# EAGLE design EgyptATTINY44 (EAGLE 9.5.2)
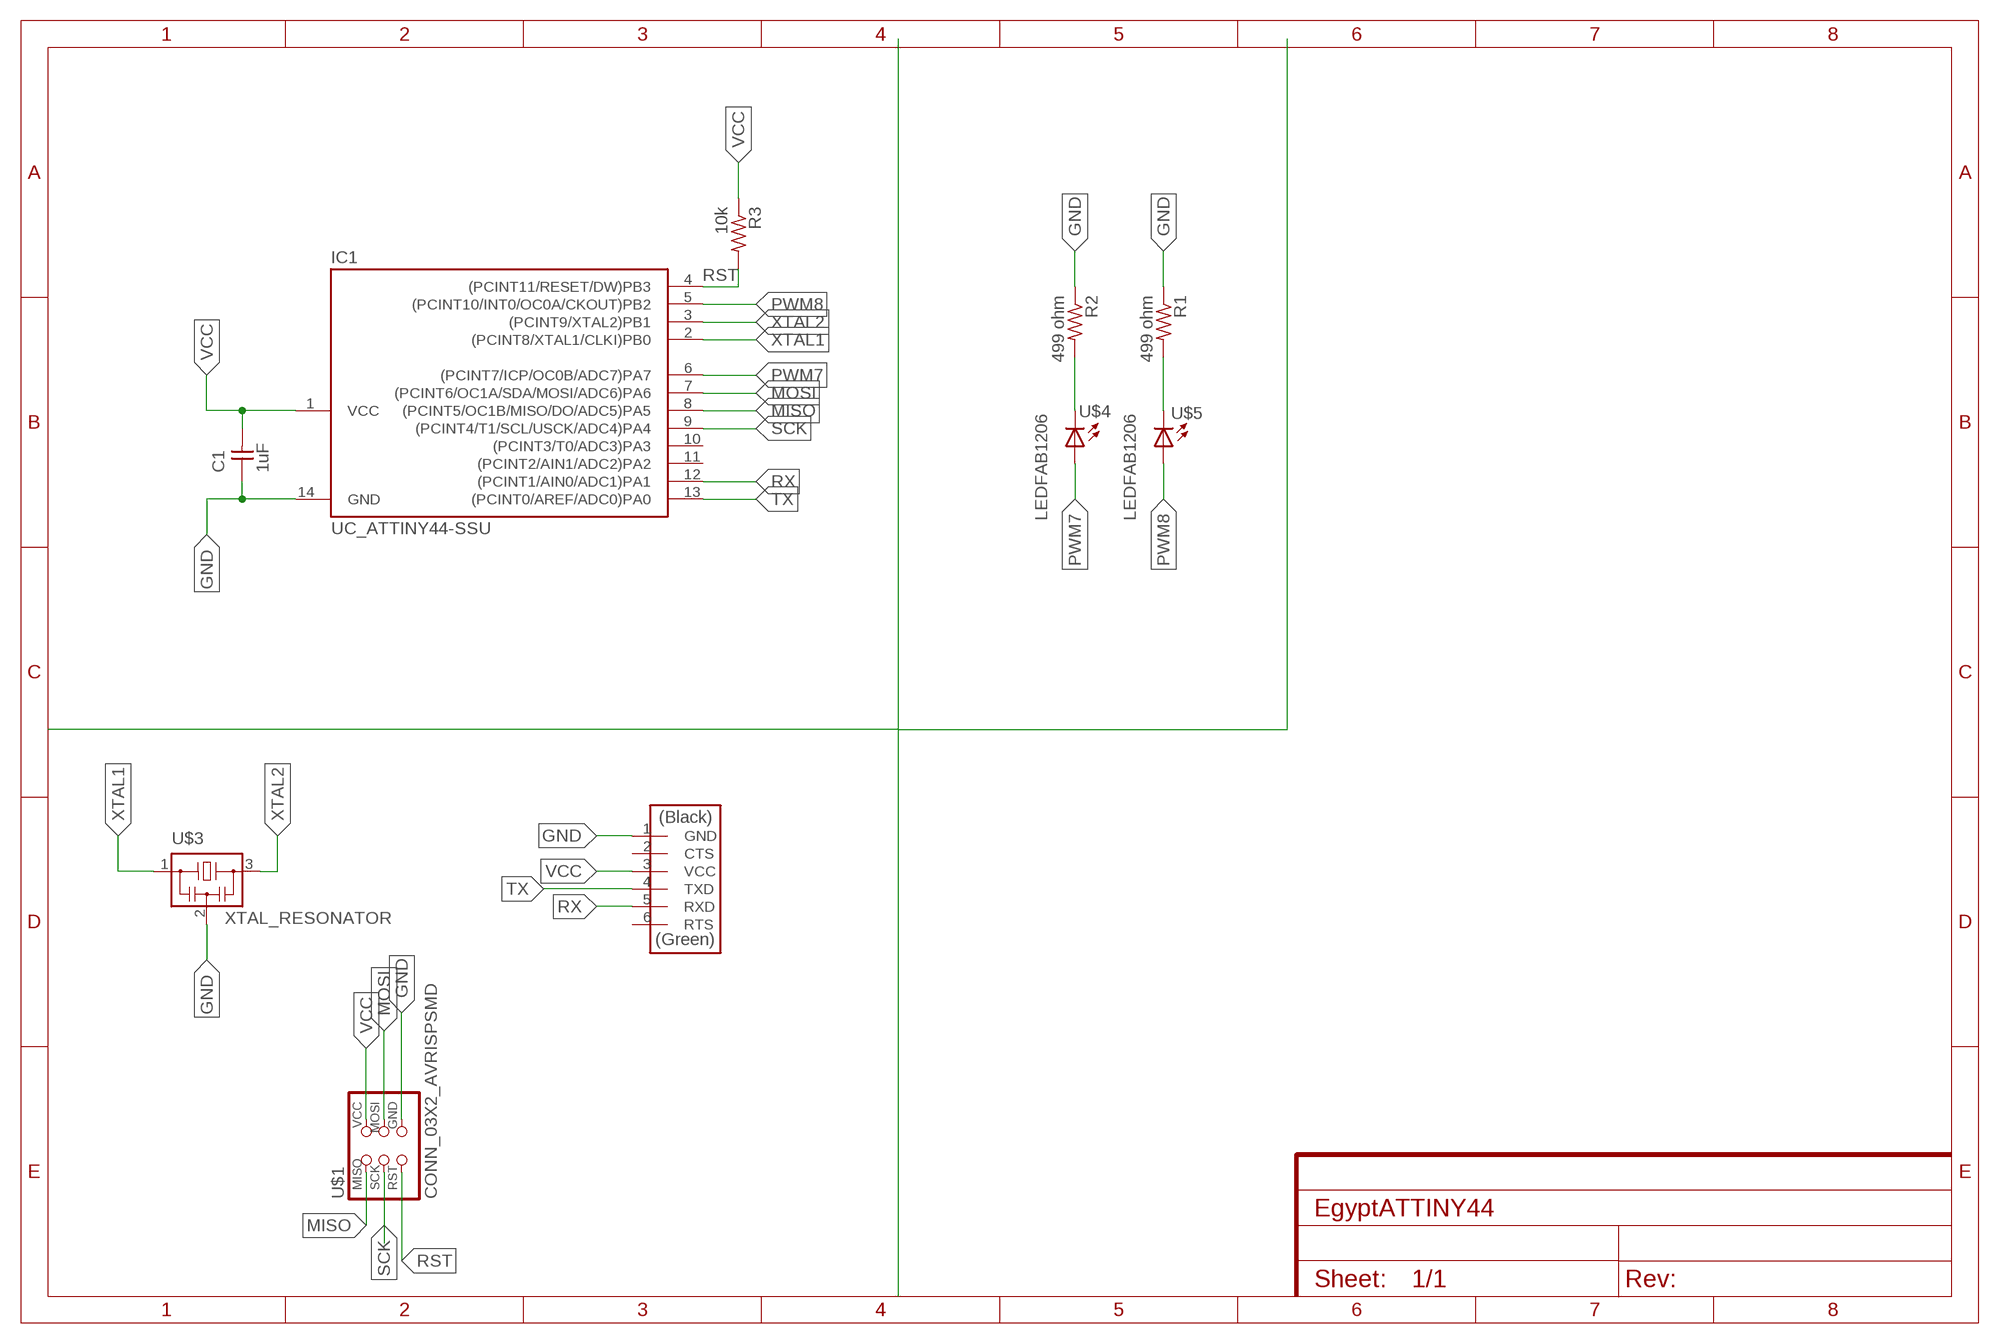
[diagram p0: schematic, sheet 1]

## Parts
C1  1uF  CAP_UNPOLARIZEDFAB  [C1206FAB]
IC1  UC_ATTINY44-SSU  [SOIC14]
R1  499 ohm  R1206FAB  [R1206FAB]
R2  499 ohm  R1206FAB  [R1206FAB]
R3  10k  R1206FAB  [R1206FAB]
U$1  CONN_03X2_AVRISPSMD  [2X03SMD]
U$2  CONN_06_FTDI-SMD-HEADER  [1X06SMD]
U$3  XTAL_RESONATOR  [EFOBM]
U$4  LEDFAB1206  [LED1206FAB]
U$5  LEDFAB1206  [LED1206FAB]

## Nets
GND: C1.1 IC1.14(GND) R1.1 R2.1 U$1.6(GND) U$2.1(GND) U$3.2
MISO: IC1.8((PCINT5/OC1B/MISO/DO/ADC5)PA5) U$1.1(MISO)
MOSI: IC1.7((PCINT6/OC1A/SDA/MOSI/ADC6)PA6) U$1.4(MOSI)
N$3: R2.2 U$4.2(C)
N$4: R1.2 U$5.2(C)
PWM7: IC1.6((PCINT7/ICP/OC0B/ADC7)PA7) U$4.1(A)
PWM8: IC1.5((PCINT10/INT0/OC0A/CKOUT)PB2) U$5.1(A)
RST: IC1.4((PCINT11/RESET/DW)PB3) R3.2 U$1.5(RST)
RX: IC1.12((PCINT1/AIN0/ADC1)PA1) U$2.5(RXD)
SCK: IC1.9((PCINT4/T1/SCL/USCK/ADC4)PA4) U$1.3(SCK)
TX: IC1.13((PCINT0/AREF/ADC0)PA0) U$2.4(TXD)
VCC: C1.2 IC1.1(VCC) R3.1 U$1.2(VCC) U$2.3(VCC)
XTAL1: IC1.2((PCINT8/XTAL1/CLKI)PB0) U$3.1
XTAL2: IC1.3((PCINT9/XTAL2)PB1) U$3.3
Unconnected: IC1.10((PCINT3/T0/ADC3)PA3) IC1.11((PCINT2/AIN1/ADC2)PA2) U$2.2(CTS) U$2.6(RTS)

## Library data of the parts
C1 = fab:CAP_UNPOLARIZED
IC1 = fab:UC_ATTINY44
R1-R3 = fab:R: Resistor (US Symbol) Variants with postfix FAB are widened to allow the routing of internal traces
U$1 = fab:CONN_03X2_AVRISP
U$2 = fab:CONN_06_FTDI-SMD-HEADER
U$3 = fab:XTAL_RESONATOR
U$4 U$5 = fab:LED: LED

## Board
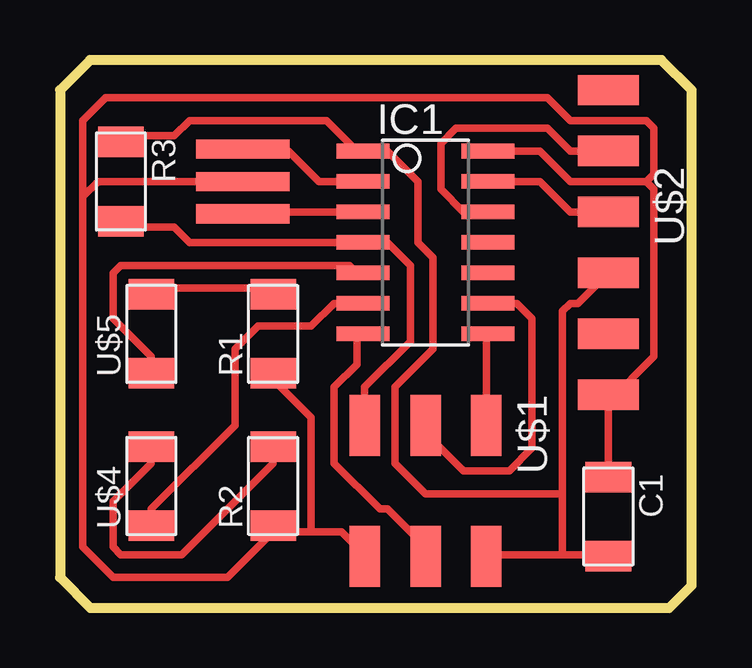
[diagram p1: board, top side]

Size 26.34 x 22.85 mm. Coordinates in mm from the lower left corner, seen from the top.
Outline: 0,21.59 0,1.27 1.27,0 25.4,0 26.34,0.94 26.34,21.59 25.08,22.85 1.26,22.85 0,21.59
Copper layers (1*16): Top 0.035mm / dielectric 1.5mm / Bottom 0.035mm
Design rules "fabcity-designrules *": minimum track width 12mil, minimum drill 32mil, track to track 16mil, track to pad 16mil, pad to pad 16mil, via to via 16mil, smd to smd 6mil, copper to edge 16mil, drill to drill 16mil, minimum pad ring 10mil, minimum via ring 8mil, stop-mask expansion 4mil, vias tented up to drill 0mil, thermal gap 16mil

### Footprints (pad centres in the part's own frame; a part is rotated, then mirrored left to right if it is on the bottom)
C1206FAB = smd 1.27 x 1.905: 1 -1.651,0; 2 1.651,0
SOIC14 = smd 0.61 x 2.21: 1 -3.81,-2.603; 2 -2.54,-2.603; 3 -1.27,-2.603; 4 0,-2.603; 5 1.27,-2.603; 6 2.54,-2.603; 7 3.81,-2.603; 8 3.81,2.603; 9 2.54,2.603; 10 1.27,2.603; 11 0,2.603; 12 -1.27,2.603; 13 -2.54,2.603; 14 -3.81,2.603
R1206FAB = smd 1.27 x 1.905: 1 -1.651,0; 2 1.651,0
2X03SMD = smd 2.54 x 1.27: 1 -2.54,2.54; 2 2.92,2.54; 3 -2.54,0; 4 2.92,0; 5 -2.54,-2.54; 6 2.92,-2.54
1X06SMD = smd 2.54 x 1.27: 1 0,6.35; 2 0,3.81; 3 0,1.27; 4 0,-1.27; 5 0,-3.81; 6 0,-6.35
EFOBM = smd 0.8 x 3.9: 1 -1.35,0; 2 0,0; 3 1.35,0
LED1206FAB = smd 1.27 x 1.905: 1 -1.651,0; 2 1.651,0

### Placement (x,y rotation side)
C1  22.86,3.81 270 top
IC1  15.24,15.24 270 top
R1  8.89,11.43 90 top
R2  8.89,5.08 90 top
R3  2.54,17.78 270 top
U$1  15.24,5.08 270 top
U$2  22.86,15.24 180 top
U$3  7.62,17.78 270 top
U$4  3.81,5.08 90 top
U$5  3.81,11.43 90 top

### Tracks (layer width: path | path; a pad name or v marks a point on that pad's centre or on a via)
GND
  Top 0.305: 22.86,8.57 C1.1 | IC1.14 20,19.05 21.27,17.78 24.45,17.78 | 24.45,17.78 24.77,17.46 24.77,10.48 22.86,8.57 | 22.86,8.57 U$2.1 | 10.48,3.17 11.75,3.17 12.7,2.22 U$1.6 | 10.48,3.17 8.89,3.17 | 10.48,3.17 10.48,7.94 8.89,9.53 R1.1 | U$3.2 1.59,17.78 0.95,17.14 | 0.95,17.14 0.95,2.54 2.22,1.27 6.99,1.27 8.89,3.17 | 8.89,3.17 R2.1 | 24.45,17.78 24.77,18.1 24.77,20 24.45,20.32 21.27,20.32 20.32,21.27 1.91,21.27 0.95,20.32 0.95,17.14
MISO
  Top 0.305: U$1.1 17.78,11.43 IC1.8
MOSI
  Top 0.305: U$1.4 15.24,2.54 13.65,4.13 13.34,4.13 11.43,6.03 11.43,9.21 12.38,10.16 12.38,11.43 IC1.7
N$3
  Top 0.305: U$4.2 3.81,6.03 2.22,4.45 2.22,2.54 2.54,2.22 5.08,2.22 8.89,6.03 R2.2
N$4
  Top 0.305: U$5.2 3.81,13.34 8.89,13.34 R1.2
PWM7
  Top 0.305: U$4.1 3.81,4.13 7.3,7.62 7.3,10.79 8.26,11.75 10.48,11.75 11.43,12.7 IC1.6
PWM8
  Top 0.305: U$5.1 3.81,10.48 2.22,12.06 2.22,13.97 2.54,14.29 12.06,14.29 12.38,13.97 IC1.5
RST
  Top 0.305: R3.2 2.54,15.88 4.76,15.88 5.4,15.24 IC1.4 13.65,15.24 14.61,14.29 14.61,11.11 12.7,9.21 U$1.5
RX
  Top 0.305: IC1.12 16.83,16.51 15.88,17.46 15.88,19.37 16.51,20 20.32,20 21.27,19.05 U$2.5
SCK
  Top 0.305: IC1.9 19.05,12.7 19.68,12.06 19.68,6.67 18.73,5.71 16.83,5.71 15.24,7.3 U$1.3
TX
  Top 0.305: IC1.13 20,17.78 21.27,16.51 U$2.4
VCC
  Top 0.305: R3.1 2.54,19.68 4.76,19.68 5.4,20.32 11.11,20.32 12.38,19.05 IC1.1 13.65,19.05 14.92,17.78 14.92,15.24 15.56,14.61 15.56,10.79 13.97,9.21 13.97,6.03 15.24,4.76 20.95,4.76 | 20.95,2.22 17.78,2.22 U$1.2 | 20.95,2.22 22.86,2.22 C1.2 | U$2.3 21.59,12.7 21.27,12.7 20.95,12.38 20.95,4.76 | 20.95,2.22 20.95,4.76
XTAL1
  Top 0.305: IC1.2 10.79,17.78 9.53,19.05 7.62,19.05 U$3.1
XTAL2
  Top 0.305: IC1.3 7.62,16.51 U$3.3

### Text on the board
tLabels: Resonator 20 mHz | 10 Kohm | LED_1206 | 499 ohm | ATTINY44A | FTDI CONN | LED_1206 | 499 ohm | ISP Header | 1uF
PinsName: VCC | GND | RX | PB0 | PA0 | PB1 | PA1 | TX | RST | PA2 | PB2 | PA3 | VCC | PA7 | PA4 | PA6 | PA5 | GND | RST | SCK | MISO | GND | MOSI | VCC